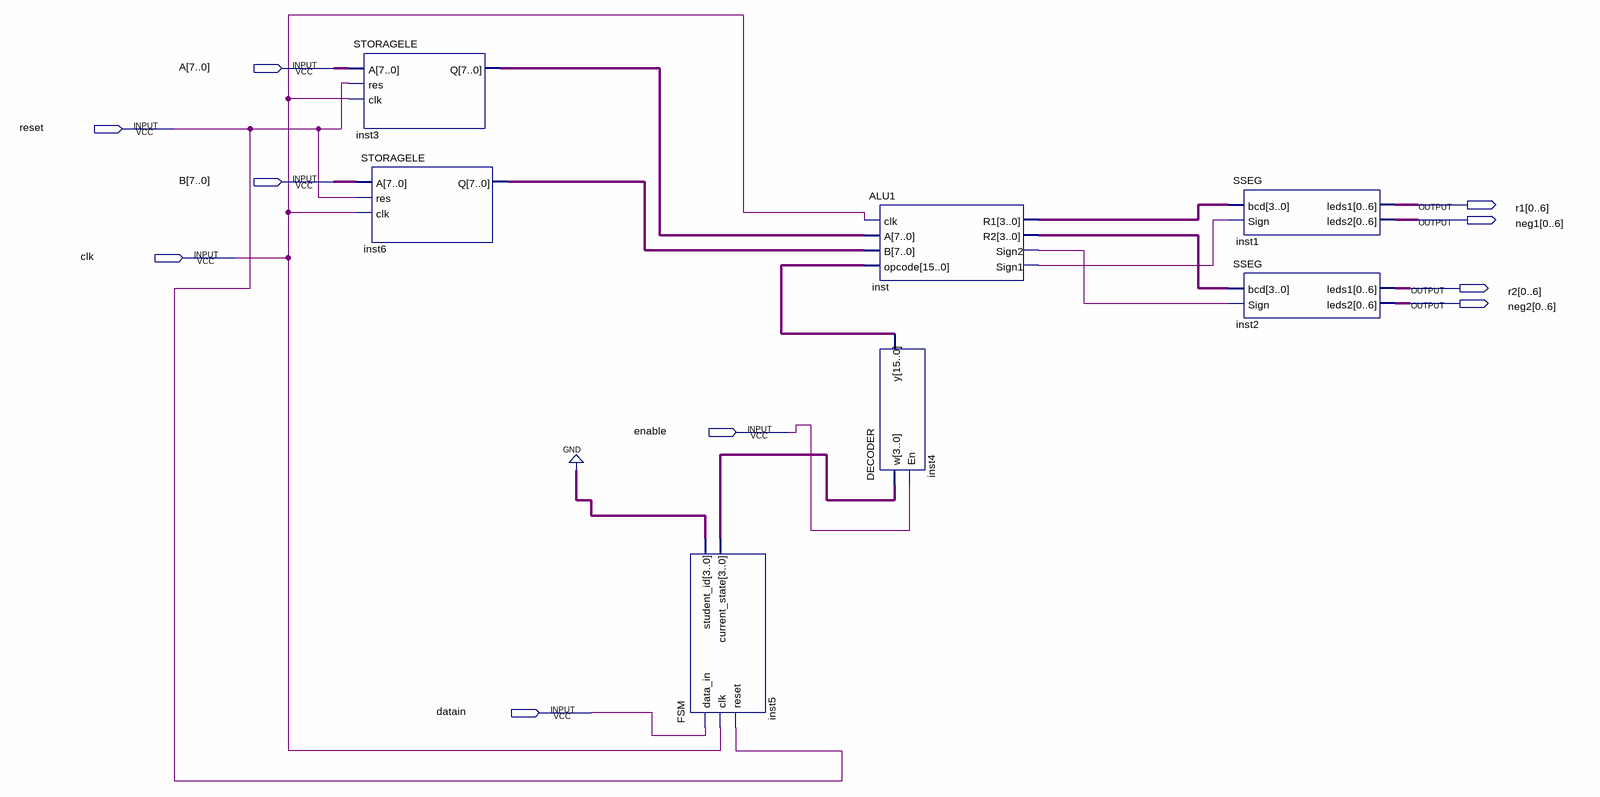
[diagram p0: schematic sheet]
// Quartus schematic PROCESSOR.bdf as structural Verilog: 7 symbols, 10 pins
module PROCESSOR (
  input  [7:0] A,
  input  reset,
  input  [7:0] B,
  input  clk,
  input  enable,
  input  datain,
  output [0:6] r1,
  output [0:6] neg1,
  output [0:6] r2,
  output [0:6] neg2
);

  wire inst_sign1, inst_sign2;
  wire [3:0] inst5_current_state, inst5_student_id, inst_r1, inst_r2;
  wire [7:0] inst3_q, inst6_q;
  wire [15:0] inst4_y;

  STORAGELE inst3 (.A(A), .res(reset), .clk(clk), .Q(inst3_q));
  STORAGELE inst6 (.A(B), .res(reset), .clk(clk), .Q(inst6_q));
  FSM inst5 (
    .data_in(datain), .clk(clk), .reset(reset), .student_id(inst5_student_id),
    .current_state(inst5_current_state));
  ALU1 inst (
    .clk(clk), .A(inst3_q), .B(inst6_q), .opcode(inst4_y), .R1(inst_r1), .R2(inst_r2), .Sign2(inst_sign2),
    .Sign1(inst_sign1));
  DECODER inst4 (.w(inst5_current_state), .En(enable), .y(inst4_y));
  SSEG inst1 (.bcd(inst_r1), .Sign(inst_sign1), .leds1(r1), .leds2(neg1));
  SSEG inst2 (.bcd(inst_r2), .Sign(inst_sign2), .leds1(r2), .leds2(neg2));
  // also tied to GND on the sheet: {inst5_student_id[0], inst5_student_id[1], inst5_student_id[2], inst5_student_id[3]}
endmodule
